# Altium schematic sheet adapter.SchDoc
size A4; Organization: Altium Limited; Address1: L3, 12a Rodborough Rd; Address2: Frenchs Forest; Address3: NSW; Address4: Australia 2086; SheetNumber: 1; SheetTotal: 1
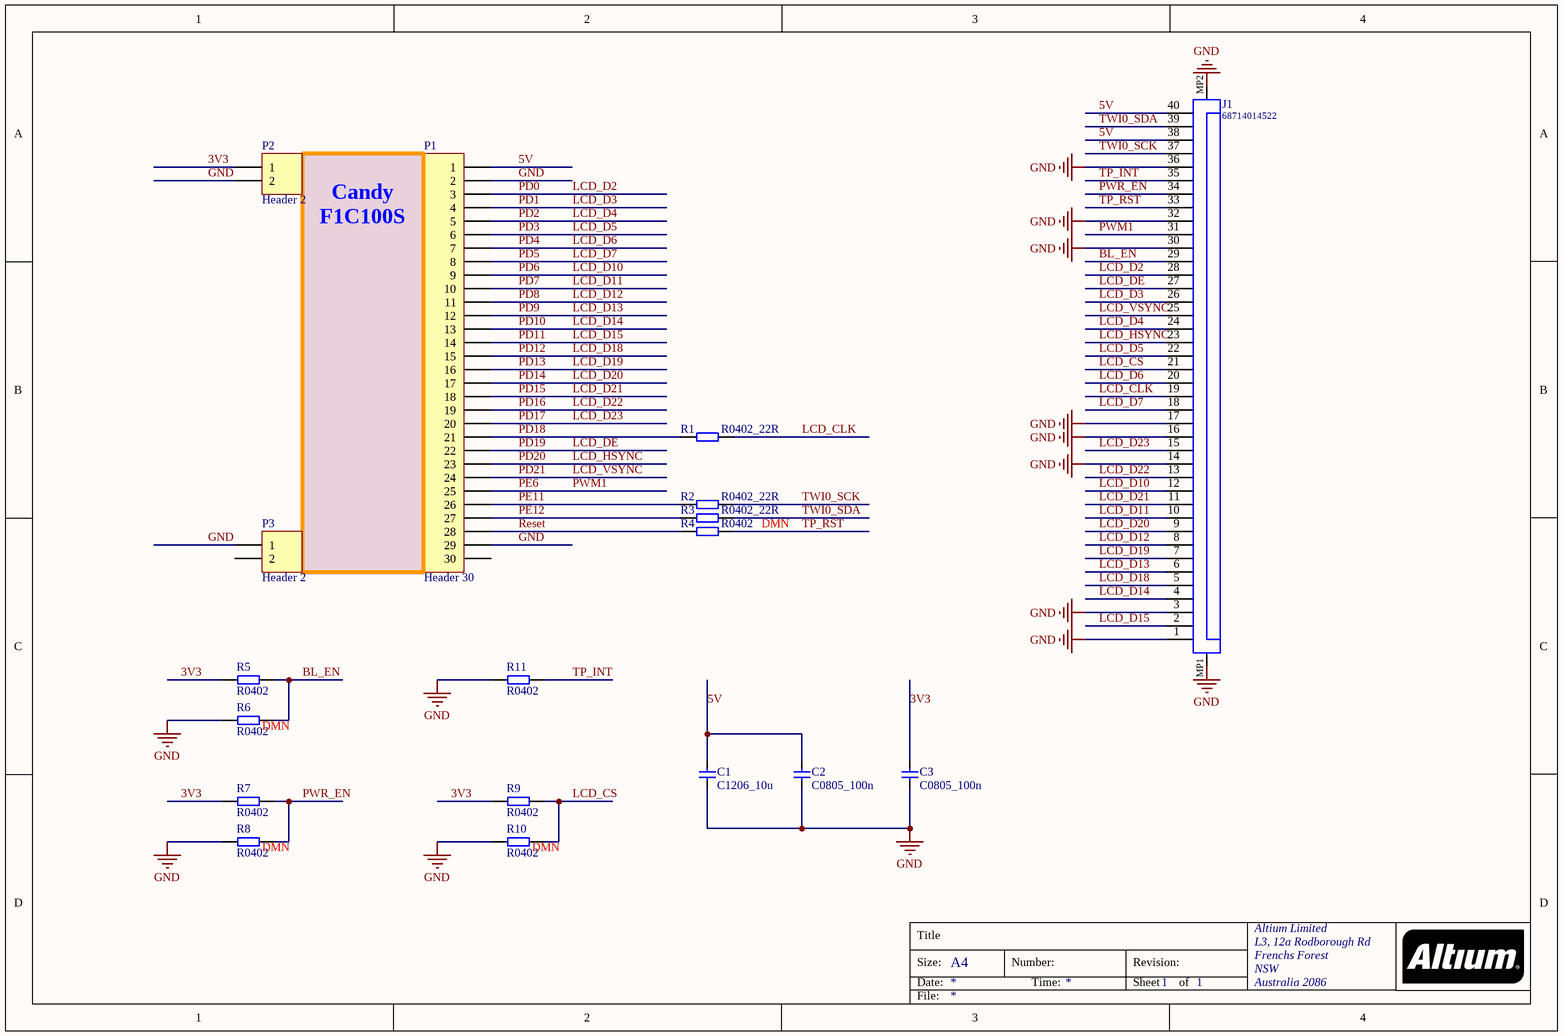
[diagram p0: adapter.SchDoc]

## Parts
C1  C1206_10u  [C1206]
C2  C0805_100n  [C0805]
C3  C0805_100n  [C0805]
J1  68714014522  [68714014522]
P1  Header 30  [HDR1X30]
P2  Header 2  [HDR1X2]
P3  Header 2  [HDR1X2]
R1  R0402_22R  [R0402]
R2  R0402_22R  [R0402]
R3  R0402_22R  [R0402]
R4  R0402  [R0402]
R5  R0402  [R0402]
R6  R0402  [R0402]
R7  R0402  [R0402]
R8  R0402  [R0402]
R9  R0402  [R0402]
R10  R0402  [R0402]
R11  R0402  [R0402]

## Nets
GND: C1.2 C2.2 C3.2 J1.1 J1.3 J1.14 J1.16 J1.17 J1.30 J1.32 J1.36 J1.MP1 J1.MP2 P1.2 P1.29 P2.2 P3.1 R6.1 R8.1 R10.1 R11.1
3V3: C3.1 P2.1 R5.1 R7.1 R9.1
5V: C1.1 C2.1 J1.38 J1.40 P1.1
BL_EN: J1.29 R5.2 R6.2
LCD_CLK: J1.19 R1.2
LCD_CS: J1.21 R9.2 R10.2
LCD_D2: J1.28 P1.3  [also labelled PD0]
LCD_D3: J1.26 P1.4  [also labelled PD1]
LCD_D4: J1.24 P1.5  [also labelled PD2]
LCD_D5: J1.22 P1.6  [also labelled PD3]
LCD_D6: J1.20 P1.7  [also labelled PD4]
LCD_D7: J1.18 P1.8  [also labelled PD5]
LCD_D10: J1.12 P1.9  [also labelled PD6]
LCD_D11: J1.10 P1.10  [also labelled PD7]
LCD_D12: J1.8 P1.11  [also labelled PD8]
LCD_D13: J1.6 P1.12  [also labelled PD9]
LCD_D14: J1.4 P1.13  [also labelled PD10]
LCD_D15: J1.2 P1.14  [also labelled PD11]
LCD_D18: J1.5 P1.15  [also labelled PD12]
LCD_D19: J1.7 P1.16  [also labelled PD13]
LCD_D20: J1.9 P1.17  [also labelled PD14]
LCD_D21: J1.11 P1.18  [also labelled PD15]
LCD_D22: J1.13 P1.19  [also labelled PD16]
LCD_D23: J1.15 P1.20  [also labelled PD17]
LCD_DE: J1.27 P1.22  [also labelled PD19]
LCD_HSYNC: J1.23 P1.23  [also labelled PD20]
LCD_VSYNC: J1.25 P1.24  [also labelled PD21]
PD18: P1.21 R1.1
PE6: J1.31 P1.25  [also labelled PWM1]
PE11: P1.26 R2.1
PE12: P1.27 R3.1
PWR_EN: J1.34 R7.2 R8.2
Reset: P1.28 R4.1
TP_INT: J1.35 R11.2
TP_RST: J1.33 R4.2
TWI0_SCK: J1.37 R2.2
TWI0_SDA: J1.39 R3.2

Not connected (* = marked no-connect by the designer): P1 30; P3 2

## Notes on the sheet
- Candy
  F1C100S
- DMN
- (near R6) DMN
- (near R8) DMN
- (near R10) DMN
- Title
- Size:
- Date:
- A4
- Number:
- Time:
- Revision:
- Sheet
- of
- File:

## Library data of the parts
C1 = CMP-003-0097-1: Manufacturer 1: Kemet; Manufacturer Part Number 1: C1206C106K4RAC; Value: 10u; Hidden Value: C106; Tolerance: 0.1%; Dielectric: X7R; Voltage Rating DC: 16V; Part Number: C1206_10u; Pin Count: 2; Component Type: Standard
C2 C3 = CMP-003-0073-1: Manufacturer 1: Kemet; Manufacturer Part Number 1: C0805C104K3RAC; Dielectric: X7R; Value: 100n; Tolerance: 0.1%; Voltage Rating DC: 25V; Hidden Value: C104; Component Type: Standard; Part Number: C0805_100n; Pin Count: 2
J1 = CMP-1502-01545-1: SMT ZIF Connectors WR-FPC, Horizontal, Bottom Contact, pitch 0.5 mm, 40 pins; Manufacturer: Wurth Elektronik; Pitch: 0.5mm; Contact Resistance: 20mOhm; Working Voltage: 50VAC; Rated Current: 0.5A; Withstanding Voltage: 250VAC; Pin Number: 40; Part Number: 68714014522; Package Reference: 68714014522; Manufacturer URL: http://www.we-online.de; Operating Temperature: -25to85degC; Publisher: WurthElektronik; Datasheet URL: https://katalog.we-online.de/em/datasheet/68714014522.pdf; Packaging: TapeandReel; Contact Design: BottomContact; Orientation: Horizontal; Mounting Technology: SMT
P1 = Header 30: Header, 30-Pin; LatestRevisionDate: 17-Jul-2002; LatestRevisionNote: Re-released for DXP Platform.; Publisher: Altium Limited
P2 P3 = Header 2: Header, 2-Pin; LatestRevisionDate: 17-Jul-2002; LatestRevisionNote: Re-released for DXP Platform.; Publisher: Altium Limited
R1-R3 = CMP-004-0379-1: Manufacturer 1: Vishay; Manufacturer Part Number 1: CRCW040222R0FKED; Value: 22R; Power Rating: 62,5mW; Tolerance: 1%; Component Type: Standard; Pin Count: 2; Part Number: R0402_22R
R4-R11 = CMP-004-0369-1: Manufacturer 1: Vishay; Manufacturer Part Number 1: CRCW0402____FKED; Power Rating: 62,5mW; Tolerance: 1%; Value: _; Part Number: R0402; Component Type: Standard; Pin Count: 2